# Altium schematic sheet onboarding_nathanlin.SchDoc
size A4; SheetNumber: 1; SheetTotal: 1; PageContents: Default Page Contents
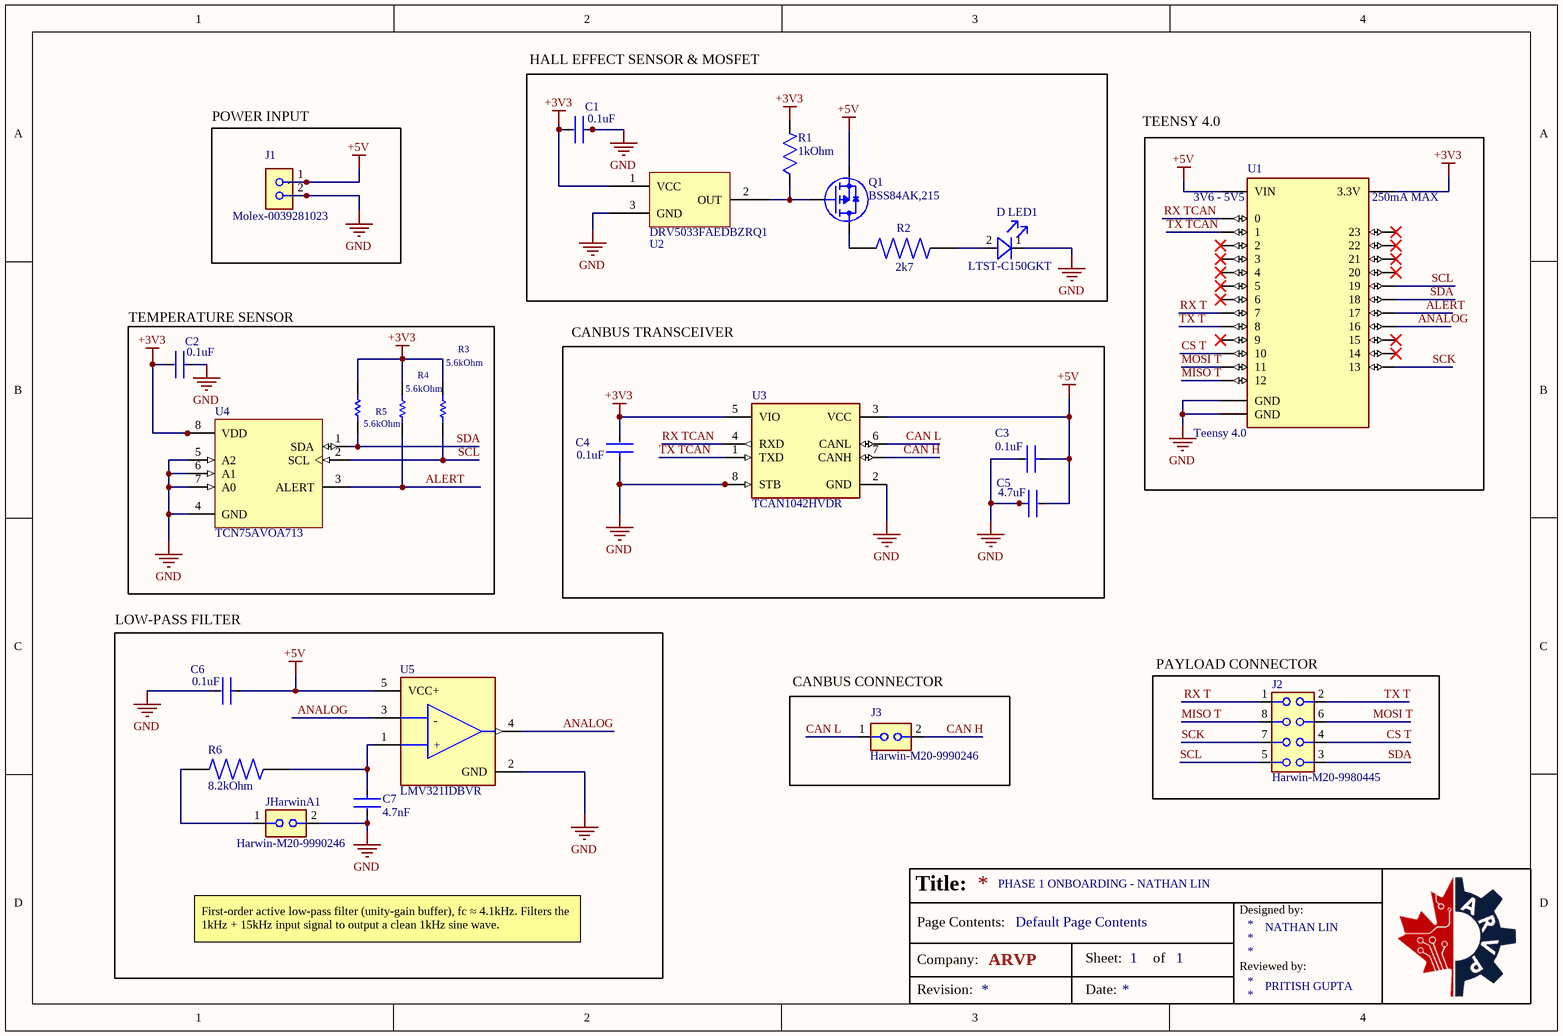
[diagram p0: onboarding_nathanlin.SchDoc]

## Parts
C1  0.1uF  [CAP_0603]
C2  0.1uF  [CAP_0603]
C3  0.1uF  [CAP_0603]
C4  0.1uF  [CAP_0603]
C5  4.7uF  [CAP_0603]
C6  0.1uF  [CAP_0603]
C7  4.7nF  [CAP_0603]
D_LED1  LTST-C150GKT  [LED_1206]
J1  Molex-0039281023  [0039281023]
J2  Harwin-M20-9980445  [HARWIN_M20-9980445]
J3  Harwin-M20-9990246  [HARWIN_M20-9990246]
JHarwinA1  Harwin-M20-9990246  [HARWIN_M20-9990246]
Q1  BSS84AK,215  [Nexperia_SOT-23-3]
R1  1kOhm  [RES_0603]
R2  2k7  [RESC1608X55N]
R3  5.6kOhm  [RESC1608X55X30LL15T15]
R4  5.6kOhm  [RESC1608X55X30LL15T15]
R5  5.6kOhm  [RESC1608X55X30LL15T15]
R6  8.2kOhm  [RESC2012X60N]
U1  Teensy 4.0  [TEENSY4.0]
U2  DRV5033FAEDBZRQ1  [TI_SOT-23-3]
U3  TCAN1042HVDR  [TI_SOIC8]
U4  TCN75AVOA713  [Microchip_SOIC8]
U5  LMV321IDBVR  [SOT95P280X145-5N]

## Blocks framed on the sheet
HALL EFFECT SENSOR & MOSFET: C1 D_LED1 Q1 R1 R2 U2
POWER INPUT: J1
TEENSY 4.0: U1
TEMPERATURE SENSOR: C2 R3-R5 U4
CANBUS TRANSCEIVER: C3-C5 U3
LOW-PASS FILTER: C6 C7 JHarwinA1 R6 U5
PAYLOAD CONNECTOR: J2
CANBUS CONNECTOR: J3

## Nets
+3V3: C1.2 C2.2 C4.2 R1.2 R3.2 R4.1 R5.1 U1.3.3V U2.1(VCC) U3.5(VIO) U4.8(VDD)
+5V: C3.1 C5.2 C6.1 J1.1 Q1.2(S) U1.VIN U3.3(VCC) U5.5(VCC+)
GND: C1.1 C2.1 C3.2 C4.1 C5.1 C6.2 C7.2 D_LED1.1(C) J1.2 JHarwinA1.2 U1.GND1(GND) U1.GND2(GND) U2.3(GND) U3.2(GND) U3.8(STB) U4.4(GND) U4.5(A2) U4.6(A1) U4.7(A0) U5.2(GND)
ALERT: R4.2 U1.17 U4.3(ALERT)
ANALOG: U1.16 U5.3(1IN-) U5.4(OUT)
CAN H: J3.2 U3.7(CANH)
CAN L: J3.1 U3.6(CANL)
CS T: J2.4 U1.10
MISO T: J2.8 U1.12
MOSI T: J2.6 U1.11
RX T: J2.1 U1.7
RX TCAN: U1.0 U3.4(RXD)
SCK: J2.7 U1.13
SCL: J2.5 R3.1 U1.19 U4.2(SCL)
SDA: J2.3 R5.2 U1.18 U4.1(SDA)
TX T: J2.2 U1.8
TX TCAN: U1.1 U3.1(TXD)
NetC7_1: C7.1 R6.2 U5.1(1IN+)
NetD_LED1_2: D_LED1.2(A) R2.1
NetJHarwinA1_1: JHarwinA1.1 R6.1
NetQ1_1: Q1.1(G) R1.1 U2.2(OUT)
NetQ1_3: Q1.3(D) R2.2

Not connected (* = marked no-connect by the designer): U1 2* 3* 4* 5* 6* 9* 14* 15* 20* 21* 22* 23*

## Notes on the sheet
- PHASE 1 ONBOARDING - NATHAN LIN
- First-order active low-pass filter (unity-gain buffer), fc ≈ 4.1kHz. Filters the 1kHz + 15kHz input signal to output a clean 1kHz sine wave.
- NATHAN LIN
- PRITISH GUPTA
- Labels drawn without touching a wire or pin: \
- Title:
- Designed by:
- Page Contents:
- Company:
- ARVP
- Sheet:
- of
- Reviewed by:
- Revision:
- Date:
- (in symbol CMP-009-000000-26) 3V6 - 5V5; 250mA MAX
- (in symbol CMP-095-000002-10) -; +

## Library data of the parts
C1-C4 C6 = CMP-097-000004-12: CAP CER 0.1UF 50V X7R 0603; Value: 100nF; Tolerance (fill in as +-): 10%; Capacitor Type: Ceramic; Multilayer: Yes; Width: 0.8mm; Pins: 2; Case/Package: 0603; Max Operating Temperature: 125°C; Package Style: SMTMeter; Terminal Finish: Nickel; RoHS Compliant: Yes; Height: 0.8mm; Reach SVHC Compliant: Yes; JLCPCB Part No.: C14663; Tolerance  (fill in as +-): 10%; Temperature Characteristics Code: X7R; Rated DC Voltage (URdc): 50V; JESD-609 Code: e3; Termination: Wraparound; Dielectric Material: Ceramic; Length: 1.6mm; Package Shape: Rectangular; Min Operating Temperature: -55°C; Packaging: Tape and Reel; Mounting Technology: Surface Mount
C5 = CMP-097-000005-7: CAP CER 4.7UF 16V X5R 0603; Tolerance (fill in as +-): 10%; Dielectric Material: Ceramic; Multilayer: Yes; Pins: 2; Termination: Wraparound; Value: 4.7uF; Packaging: Tape and Reel; Package Shape: Rectangular; RoHS Compliant: Yes; Terminal Finish: Nickel; Width: 0.8mm; JLCPCB Part No.: C19666; Length: 1.6mm; Tolerance  (fill in as +-): 10%; Reach SVHC Compliant: Yes; Rated DC Voltage (URdc): 16V; Height: 0.9mm; JESD-609 Code: e3; Package Style: SMTMeter; Min Operating Temperature: -55°C; Capacitor Type: Ceramic; Case/Package: 0603; Temperature Characteristics Code: X5R; Mounting Technology: Surface Mount; Max Operating Temperature: 85°C
C7 = CMP-00057-1: 4700 pF ±10% 50V Ceramic Capacitor X7R 0603 (1608 Metric); Multilayer: Yes; Mounting Technology: Surface Mount; Value: 4.7nF; Temperature Characteristics Code: X7R; JLCPCB Part No.: C1621; Terminal Finish: Nickel; Min Operating Temperature: -55°C; Packaging: Tape and Reel; Reach SVHC Compliant: Yes; Height: 0.9mm; Termination: Wraparound; Max Operating Temperature: 125°C; Pins: 2; Tolerance  (fill in as +-): 10%; Rated DC Voltage (URdc): 50V; Width: 0.8mm; RoHS Compliant: Yes; Dielectric Material: Ceramic; Capacitor Type: Ceramic; JESD-609 Code: e3; Case/Package: 0603; Package Style: SMTMeter; Length: 1.6mm; Tolerance (fill in as +-): 10%; Package Shape: Rectangular
D_LED1 = CMP-00008-10: LED GREEN CLEAR 1206 SMD; Dominant Wavelength: 569nm; Lens Style: Flat,Diffused,Colorless,Rectangular,Clear; Number of Elements: 1; Max Power Dissipation: 100mW; Lens Color: Colorless; Forward Current: 30mA; Test Current: 10mA; Reverse Voltage: 5V; Luminous Intensity: 6mcd; Viewing Angle: 130°; Forward Voltage: 2.1V; Wavelength: 565nm; Lens Size: 1.6mm; Lead Free: Lead Free; Max Operating Temperature: 85°C; Case Code (Imperial): 1206; RoHS Compliant: Yes; Pins: 2; Lens Transparency: Clear; JLCPCB Part No.: C125084; Width: 1.6mm; Radiation Hardening: No; Power Dissipation: 100mW; Depth: 1.6mm; Min Operating Temperature: -55°C; Illumination Color: Green; Height: 1.1mm; Number of LEDs: 1; Case/Package: 1206; Color: Green; Package Quantity: 3000; Length: 3.2mm; Case Code (Metric): 3216; Packaging: Tape and Reel; Mounting Technology: Surface Mount; Series: -; Power Rating: 100mW
J1 = CMP-00006-5: Connector Header Through Hole 2 position; Contact Resistance: 10mR; Gender: Male; Max Current Rating: 15A; Number of Ports: 1; Approvals: UL,CSA,TUV; Connector Type: Power,Rectangular; Insulation Resistance: 1GR; Row Spacing: 0.165inch; Voltage Rating (DC): 600V; Number of Contacts: 2; Current Rating: 9A; Working Voltage: 250V; Pitch: 4.2mm; Glow Wire Compliant: Non-compliant; Contact Plating: Tin,Copper; Halogen Free: Low Halogen; JLCPCB Part No.: C9900017326; Mount: Through Hole,Board; Depth: 11mm; Housing Color: Natural; RoHS Compliant: Yes; Housing Material: Nylon; Length: 6.2mm; Contact Gender: Male; Termination: Solder; Orientation: Straight; Contact Material: Brass; Max Operating Temperature: 105°C; Number of Poles: 2; Lead Pitch: 4.2mm; Number of Rows: 2; Radiation Hardening: No; Voltage Rating (AC): 600V; Height: 12mm; Flammability Rating: UL94 V-2; Number of Circuits: 2; Max Voltage Rating (DC): 600V; Contact Type: Male Pin; Packaging: Tray; Color: Natural,Clear; Reach SVHC Compliant: Unknown; Number of Positions: 2; Min Operating Temperature: -40°C; Package Quantity: 1200; Series: Mini-Fit® Jr™ 5566; Max Voltage Rating (AC): 600V; Fastening Type: Ramp; Voltage Rating: 600V; Lead Free: Lead Free
J2 = CMP-025-000000-12: Connector Header Through Hole 8 position 0.100" (2.54mm); PCB Contact Pattern: RECTANGULAR; MIL Conformance: No; Number of Rows Loaded: 1; Durability: 300Cycles; Connector Type: BOARD CONNECTOR; Insulation Resistance: 1GR; Contact Style: SQ PIN-SKT; Reference Standard: UL; Body Depth: 0.1inch; MF: Harwin Inc.; Option: General Purpose; Body Breadth: 0.2inch; Body Length: 0.4inch; Contact Resistance: 25mR; Number of Contacts: 8; Reliability: COMMERCIAL; Rated Current (Signal): 3A; Dielectric Withstanding Voltage (AC): 750V; Body/Shell Style: RECEPTACLE; Flammability Rating: UL94 V-0; Mounting Technology: Board; Component Type: Standard; Insulation Color: Black; Contact Finish - Termination: Gold (Au) - with Nickel (Ni) barrier; Insulation Material: Nylon; JLCPCB Part No.: C6897587; Value: *; Min Operating Temperature: -40°C; Reach SVHC Compliant: Yes; Number Of PCB Rows: 1; Source: SnapEDAsch.SchLib; Contact Finish - Mating: GOLD; Mounting Style: STRAIGHT; DIN Conformance: No; Mating Contact Pitch: 0.1inch; Price: None; SnapEDA_Link: https://www.snapeda.com/parts/M20-9980445/Harwin%20Inc./view-part/282788/?ref=snap; Availability: Unavailable; IEC Conformance: No; Max Operating Temperature: 105°C; Contact Pattern: RECTANGULAR; RoHS Compliant: Yes; Package: None; Mixed Contacts: No; Number Of Connectors: 1; Terminal Length: 0.118inch; MP: M20-9980445; JESD-609 Code: e4; Design Item ID: M20-9980445; Termination: Solder; Filter Feature: No; Pin Count: 8; Terminal Pitch: 2.54mm; Contact Gender: Male
J3 JHarwinA1 = CMP-00000-10: Connector Header Through Hole 2 position 0.100" (2.54mm); Number of Positions: 2; Contact Resistance: 30mR; Voltage Rating (AC): 750V; Max Current Rating: 3A; Insulation Resistance: 10GR; Gender: Male; Case/Package: SIL; Termination: Solder; Mount: Through Hole; Housing Material: Nylon; Max Operating Temperature: 105°C; JLCPCB Part No.: C3332353; Orientation: Straight; Contact Material: Bronze,Brass; Depth: 2.54mm; Current Rating: 3A; Radiation Hardening: No; Pitch: 2.54mm; Reach SVHC Compliant: No; Length: 5.08mm; Number of Rows: 1; Series: M20; Packaging: Bulk; Contact Plating: Tin; Contact Type: Male Pin; Color: Black; Contact Mating Length: 0.24inch; Package Quantity: 1000; Housing Color: Black; Min Operating Temperature: -40°C; Number of Contacts: 2
Q1 = CMP-00009-12: P-Channel 50 V 180mA (Ta) 350mW (Ta), 1.14W (Tc) Surface Mount TO-236AB; DS Breakdown Voltage-Min: 50V; Package Body Material: Plastic; Reference Standard: AEC-Q101; Transistor Application: SWITCHING; FET Technology: METAL-OXIDE SEMICONDUCTOR; Drain-source On Resistance-Max: 8.5R; Time @ Peak Reflow Temperature-Max (s): 30s; Transistor Element Material: SILICON; Number of Elements: 1; Operating Mode: ENHANCEMENT MODE; JESD-30 Code: R-PDSO-G3; JLCPCB Part No.: C127273; Reach SVHC Compliant: Yes; Drain Current-Max (ID): 180mA; JESD-609 Code: e3; Moisture Sensitivity Level: 1; Pins: 3; Package Style: SMALL OUTLINEMeter; Terminal Position: DUAL; Terminal Finish: Tin; Surface Mount: Yes; Package Shape: Rectangular; JEDEC-95 Code: TO-236AB; RoHS Compliant: Yes; Terminal Form: Gull Wing; Peak Reflow Temperature (Cel): 260°C; Polarity/Channel Type: P-CHANNEL
R1 = CMP-019-000000-16: 1 kOhms ±1% 0.1W, 1/10W Chip Resistor 0603 (1608 Metric) Moisture Resistant Thick Film; Working Voltage: 75V; Power: 100mW; Package Width: 0.8mm; Temperature Coefficient: 100ppm/°C; Package Length: 1.6mm; MP: RC0805FR-071KL; MF: Yageo; Package Height: 0.45mm; Value: 1kR; Rated Temperature: 70°C; Additional Feature: LASER TRIMMABLE; Check_prices: https://www.snapeda.com/parts/RC0805FR-071KL/Yageo/view-part/?ref=eda; Component Type: Standard; Reach SVHC Compliant: Yes; SnapEDA_Link: https://www.snapeda.com/parts/RC0805FR-071KL/Yageo/view-part/?ref=snap; Terminal Finish: Nickel; Min Operating Temperature: -55°C; Packaging: Tape and Reel; Pins: 2; Mounting Technology: Surface Mount; JESD-609 Code: e3; Technology: METAL GLAZE/THICK FILM; Construction: Chip; Max Operating Temperature: 155°C; Tolerance: 1%; Purchase-URL: https://pricing.snapeda.com/search/part/RC0805FR-071KL/?ref=eda; Design Item ID: RC0805FR-071KL; Termination: Wraparound; Availability: In Stock; Package Shape: Rectangular; Package Style: SMTMeter; Pin Count: 2; Package: 2012 Rohm Semiconductor; Resistor Type: FIXED RESISTOR; Source: RC0805FR-071KL.SchLib; RoHS Compliant: Yes; Case/Package: 0603; JLCPCB Part No.: C22548; Price: None
R2 = CMP-234-000000-3: 2.7 kOhms Â±5% 0.1W, 1/10W Chip Resistor 0603 (1608 Metric) Moisture Resistant Thick Film; MF: Yageo; Package: 1608 Yageo; Check_prices: https://www.snapeda.com/parts/RC0603JR-072K7L/Yageo/view-part/?ref=eda; Source: RC0603JR-072K7L.SchLib; Value: *; Design Item ID: RC0603JR-072K7L; SnapEDA_Link: https://www.snapeda.com/parts/RC0603JR-072K7L/Yageo/view-part/?ref=snap; MP: RC0603JR-072K7L; Component Type: Standard; Pin Count: 2
R3-R5 = CMP-234-000004-1: Res Thick Film 0603 5.6K Ohm 5% 1/10W ±200ppm/°C Molded SMD Punched Carrier T/R; Value: 5.6kΩ
R6 = CMP-234-000001-2: 8.2 kOhms Â±5% 0.125W, 1/8W Chip Resistor 0805 (2012 Metric) Moisture Resistant Thick Film; MF: Yageo; Source: RC0805JR-078K2L.SchLib; Component Type: Standard; Value: *; SnapEDA_Link: https://www.snapeda.com/parts/RC0805JR-078K2L/Yageo/view-part/?ref=snap; Check_prices: https://www.snapeda.com/parts/RC0805JR-078K2L/Yageo/view-part/?ref=eda; Package: 2012 Yageo; Design Item ID: RC0805JR-078K2L; Pin Count: 2; MP: RC0805JR-078K2L
U1 = CMP-009-000000-26: RT1062 Teensy 4.0 i.MX ARM® Cortex®-M7 MPU Embedded Evaluation Board
U2 = CMP-00001-8: Digital Switch Omnipolar Switch Open Drain Hall Effect SOT-23-3; Max Output current: 30A; Output Range: 0-38V; Magnetic Field Range-Min: -0.5mT; Output Type: DIGITAL VOLTAGE; Package Shape/Style: Rectangular; Hysteresis: 1.5mT; Operating Current-Max: 3.6mA; Min Supply Voltage: 2.7V; Body Breadth: 1.3inch; Max Supply Voltage: 38V; Sensor Type: MAGNETIC FIELD SENSOR,HALL EFFECT; Output Interface Type: 2-Wire; Magnetic Field Range-Max: 6mT; Body Height: 1.005mm; Body Length or Diameter: 2.92mm; Mounting Technology: Surface Mount; JLCPCB Part No.: C2655029; Min Operating Temperature: -40°C; RoHS Compliant: Yes; JESD-609 Code: e3; Housing Material: Plastic; Termination: Solder; Reach SVHC Compliant: Yes; Max Operating Temperature: 125°C; Terminal Finish: Tin
U3 = CMP-00002-18: 1/1 Transceiver CANbus 8-SOIC; Receiver Hysteresis: 120mV; Max Supply Voltage: 5.5V; Nominal Supply Voltage: 5V; Data Rate: 2Mbps; Min Supply Voltage: 4.5V; Number of Receive Buffers: 1; Max Operating Temperature: 125°C; Reach SVHC Compliant: No; RoHS Compliant: Yes; Case/Package: SOP; Lead Free: Lead Free; Pins: 8; Min Operating Temperature: -55°C; Number of Pins: 8; Packaging: Cut Tape; Series: -; Mount: Surface Mount; JLCPCB Part No.: C127869; Number of Transmit Buffers: 1
U4 = CMP-00017-3: Temperature Sensor Digital, Local -40°C ~ 125°C 11 b 8-SOIC; Package Shape/Style: Rectangular; Body Breadth: 3.91inch; Min Supply Voltage: 2.7V; Max Supply Voltage: 5.5V; Operating Current-Max: 200uA; Output Interface Type: I2C; Package Body Material: Plastic; Sensor Type: TEMPERATURE SENSOR,SWITCH/DIGITAL OUTPUT,SERIAL; Body Height: 1.55mm; Accuracy-Max (Cel): 2°C; Package Equivalence Code: SOP8,.25; Number of Bits: 12; Body Length or Diameter: 4.9mm; Power Supplies: 3/5V; Terminal Finish: Tin; Mounting Technology: Surface Mount; Termination: Solder; RoHS Compliant: Yes; Reach SVHC Compliant: Yes; Min Operating Temperature: -40°C; Pins: 8; Max Operating Temperature: 125°C; JLCPCB Part No.: C144313; Housing Material: Plastic; JESD-609 Code: e3
U5 = CMP-095-000002-10: General Purpose Amplifier 1 Circuit Rail-to-Rail SOT-23-5; Packaging: Tape and Reel; RoHS Compliant: Yes; JLCPCB Part No.: C7972; Max Operating Temperature: 125°C; Min Operating Temperature: -40°C; Case/Package: LSSOP